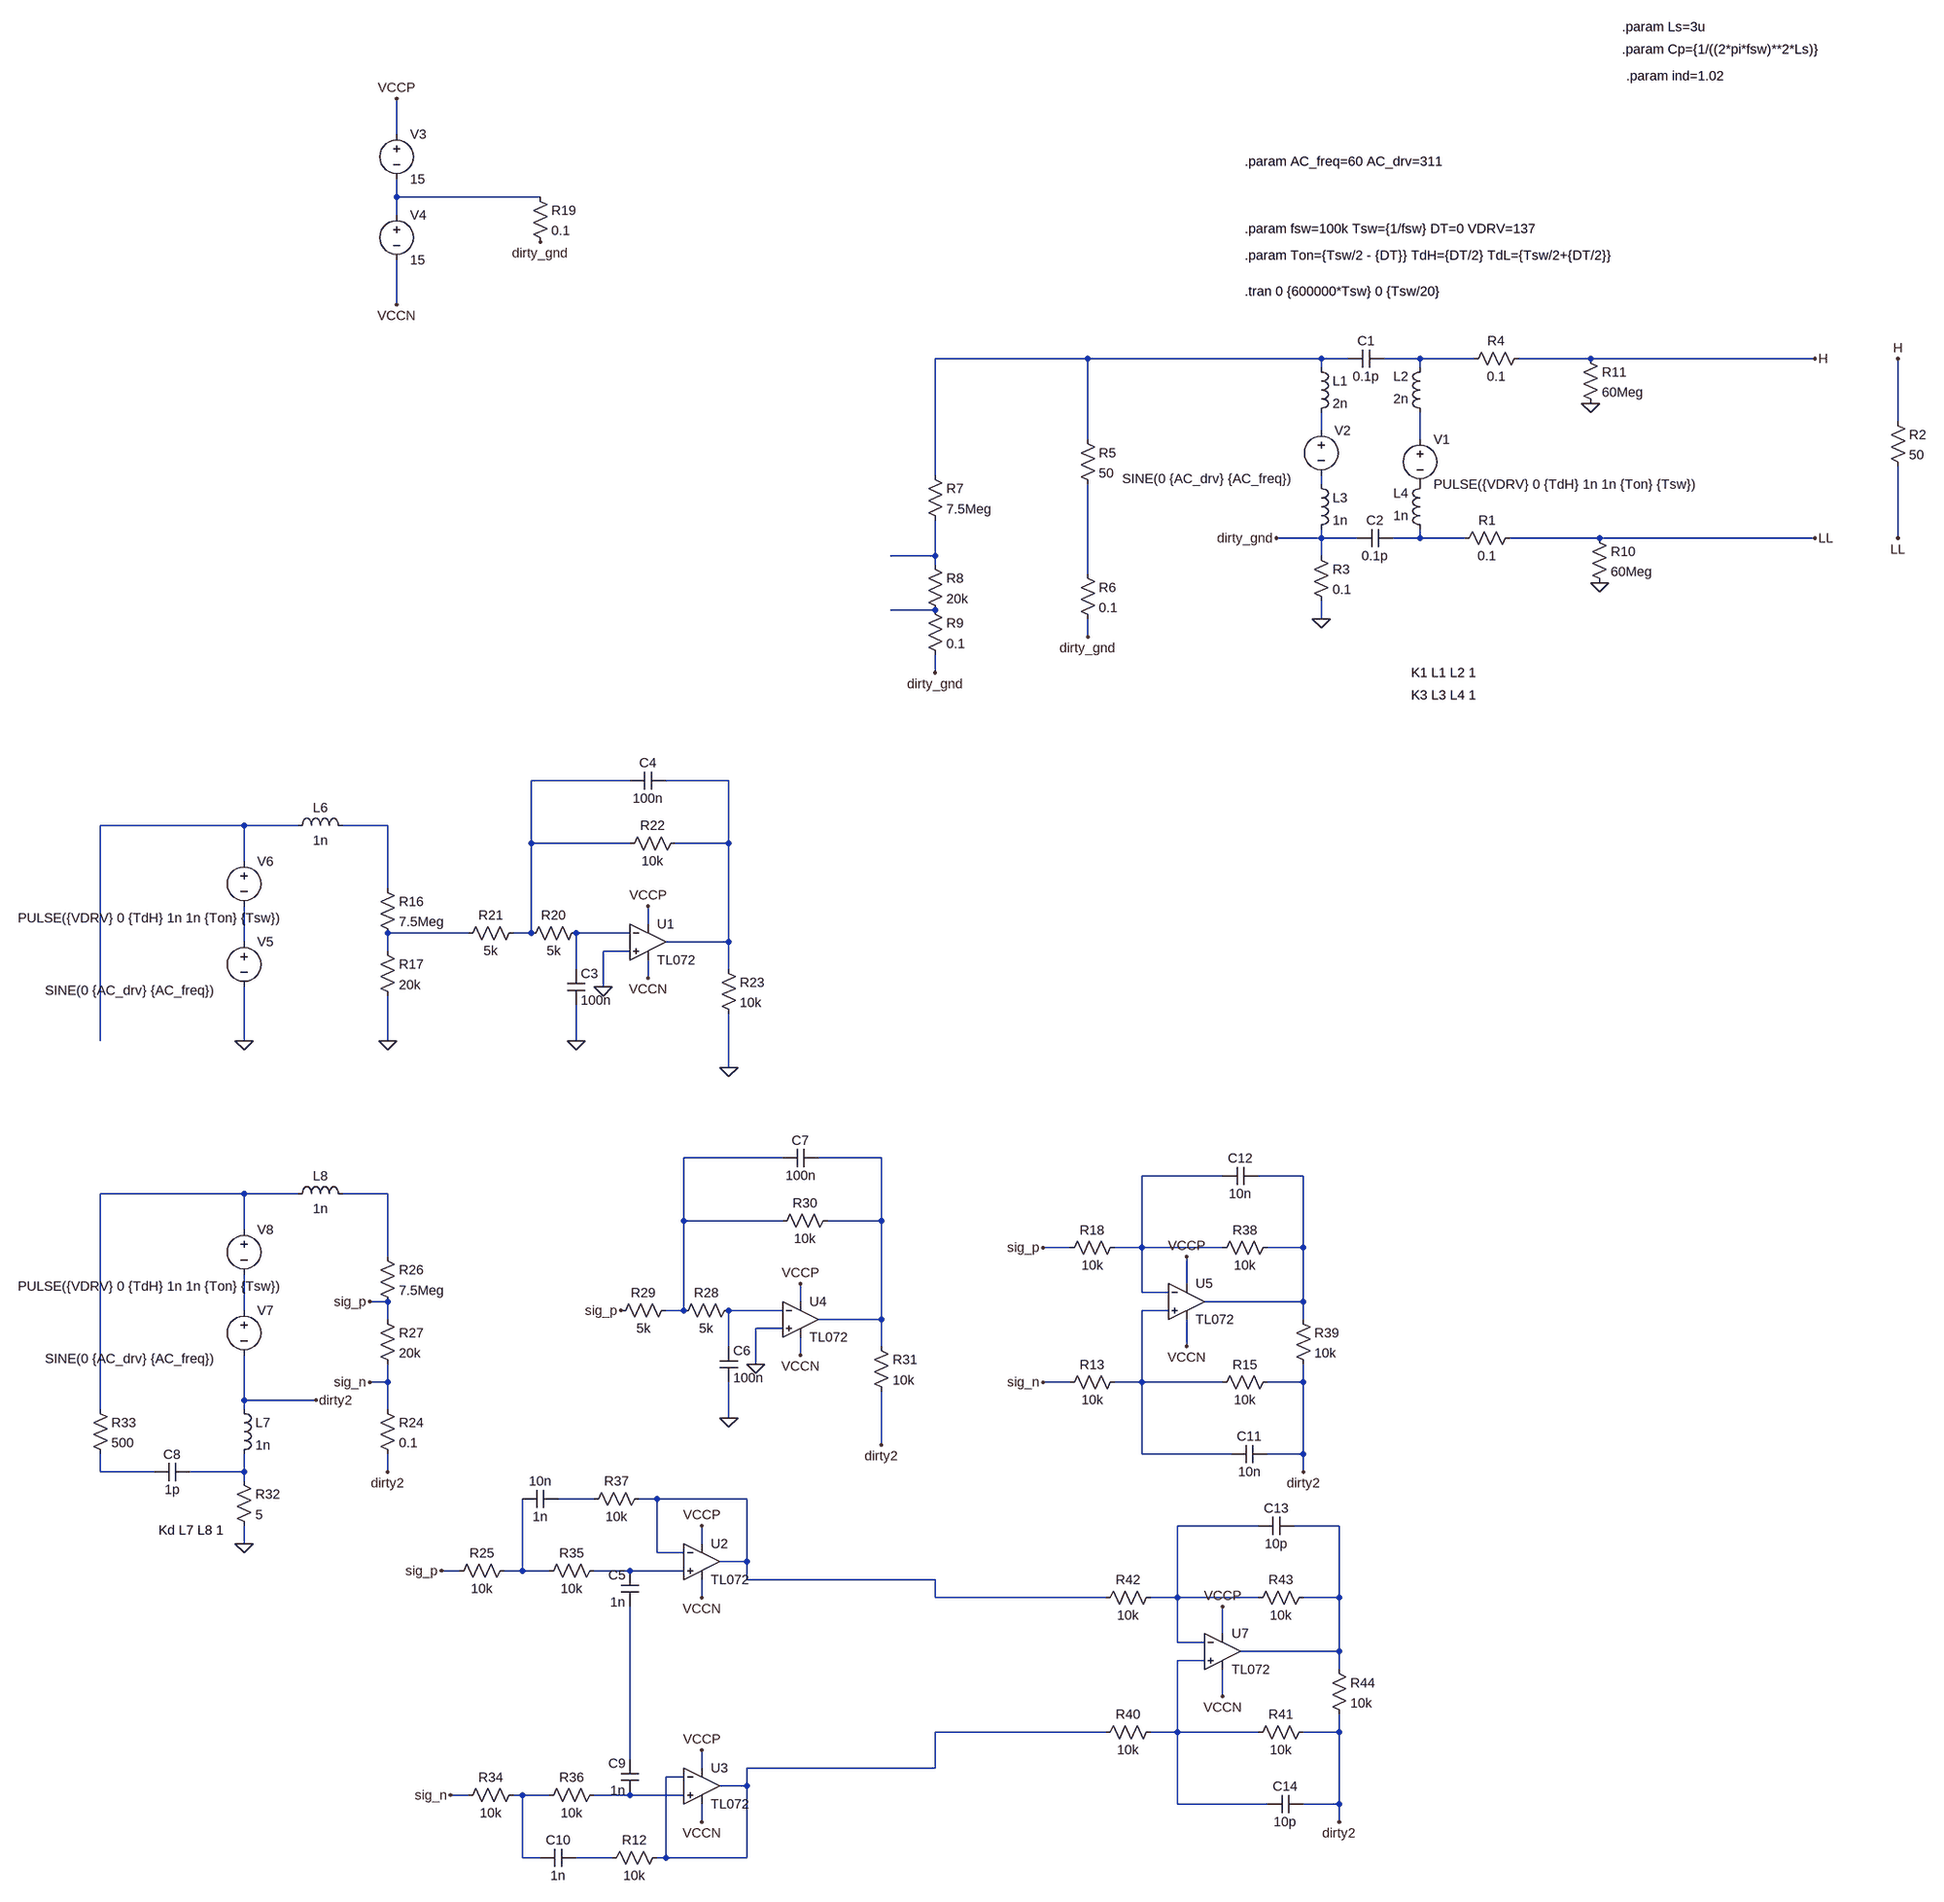
[diagram p0: schematic CM_Noise.asc]
CM_Noise.asc, the LTspice schematic file:
Version 4.1
SHEET 1 2900 3132
WIRE -1776 -320 -1776 -384
WIRE -1776 -208 -1776 -240
WIRE -1520 -208 -1776 -208
WIRE -1776 -176 -1776 -208
WIRE -1776 -16 -1776 -96
WIRE -544 80 -816 80
WIRE -128 80 -544 80
WIRE -80 80 -128 80
WIRE 48 80 -16 80
WIRE 144 80 48 80
WIRE 352 80 224 80
WIRE 752 80 352 80
WIRE -128 96 -128 80
WIRE 48 96 48 80
WIRE 1040 192 1040 80
WIRE -128 208 -128 176
WIRE -544 224 -544 80
WIRE 48 224 48 176
WIRE -816 288 -816 80
WIRE -128 304 -128 288
WIRE -128 400 -128 384
WIRE -128 400 -208 400
WIRE -64 400 -128 400
WIRE 48 400 48 384
WIRE 48 400 0 400
WIRE 128 400 48 400
WIRE 368 400 208 400
WIRE 752 400 368 400
WIRE 1040 400 1040 272
WIRE -816 432 -816 368
WIRE -816 432 -896 432
WIRE -128 432 -128 400
WIRE -816 448 -816 432
WIRE -544 464 -544 304
WIRE -816 528 -896 528
WIRE -128 544 -128 512
WIRE -544 576 -544 544
WIRE -816 640 -816 608
WIRE -1360 1024 -1536 1024
WIRE -1184 1024 -1296 1024
WIRE -2048 1104 -2304 1104
WIRE -1952 1104 -2048 1104
WIRE -1792 1104 -1872 1104
WIRE -1536 1136 -1536 1024
WIRE -1360 1136 -1536 1136
WIRE -1184 1136 -1184 1024
WIRE -1184 1136 -1280 1136
WIRE -2048 1168 -2048 1104
WIRE -1792 1216 -1792 1104
WIRE -1328 1280 -1328 1248
WIRE -1648 1296 -1792 1296
WIRE -1536 1296 -1536 1136
WIRE -1536 1296 -1568 1296
WIRE -1360 1296 -1456 1296
WIRE -2048 1312 -2048 1248
WIRE -1184 1312 -1184 1136
WIRE -1184 1312 -1296 1312
WIRE -1792 1328 -1792 1296
WIRE -1360 1328 -1408 1328
WIRE -1456 1360 -1456 1296
WIRE -1184 1360 -1184 1312
WIRE -1328 1376 -1328 1344
WIRE -1408 1392 -1408 1328
WIRE -2304 1488 -2304 1104
WIRE -2048 1488 -2048 1392
WIRE -1792 1488 -1792 1408
WIRE -1456 1488 -1456 1424
WIRE -1184 1536 -1184 1440
WIRE -1088 1792 -1264 1792
WIRE -912 1792 -1024 1792
WIRE -304 1824 -448 1824
WIRE -160 1824 -240 1824
WIRE -2048 1856 -2304 1856
WIRE -1952 1856 -2048 1856
WIRE -1792 1856 -1872 1856
WIRE -1264 1904 -1264 1792
WIRE -1088 1904 -1264 1904
WIRE -912 1904 -912 1792
WIRE -912 1904 -1008 1904
WIRE -2048 1920 -2048 1856
WIRE -576 1952 -624 1952
WIRE -448 1952 -448 1824
WIRE -448 1952 -496 1952
WIRE -304 1952 -448 1952
WIRE -160 1952 -160 1824
WIRE -160 1952 -224 1952
WIRE -1792 1968 -1792 1856
WIRE -368 2016 -368 1968
WIRE -448 2032 -448 1952
WIRE -400 2032 -448 2032
WIRE -1792 2048 -1824 2048
WIRE -1056 2048 -1056 2016
WIRE -160 2048 -160 1952
WIRE -160 2048 -336 2048
WIRE -2048 2064 -2048 2000
WIRE -1264 2064 -1264 1904
WIRE -1264 2064 -1296 2064
WIRE -1088 2064 -1184 2064
WIRE -400 2064 -448 2064
WIRE -1792 2080 -1792 2048
WIRE -912 2080 -912 1904
WIRE -912 2080 -1024 2080
WIRE -160 2080 -160 2048
WIRE -1088 2096 -1136 2096
WIRE -1184 2128 -1184 2064
WIRE -912 2128 -912 2080
WIRE -368 2128 -368 2080
WIRE -1056 2144 -1056 2112
WIRE -1136 2160 -1136 2096
WIRE -1792 2192 -1792 2160
WIRE -1792 2192 -1824 2192
WIRE -576 2192 -624 2192
WIRE -448 2192 -448 2064
WIRE -448 2192 -496 2192
WIRE -304 2192 -448 2192
WIRE -160 2192 -160 2160
WIRE -160 2192 -224 2192
WIRE -2048 2224 -2048 2144
WIRE -1920 2224 -2048 2224
WIRE -2304 2240 -2304 1856
WIRE -2048 2240 -2048 2224
WIRE -1792 2240 -1792 2192
WIRE -1184 2256 -1184 2192
WIRE -912 2304 -912 2208
WIRE -448 2320 -448 2192
WIRE -288 2320 -448 2320
WIRE -160 2320 -160 2192
WIRE -160 2320 -224 2320
WIRE -2304 2352 -2304 2320
WIRE -2208 2352 -2304 2352
WIRE -2048 2352 -2048 2320
WIRE -2048 2352 -2144 2352
WIRE -1792 2352 -1792 2320
WIRE -160 2352 -160 2320
WIRE -2048 2368 -2048 2352
WIRE -1424 2400 -1488 2400
WIRE -1312 2400 -1344 2400
WIRE -1152 2400 -1312 2400
WIRE -240 2448 -384 2448
WIRE -96 2448 -176 2448
WIRE -2048 2480 -2048 2448
WIRE -1232 2480 -1232 2448
WIRE -1312 2496 -1312 2400
WIRE -1264 2496 -1312 2496
WIRE -1152 2512 -1152 2400
WIRE -1152 2512 -1200 2512
WIRE -1664 2528 -1696 2528
WIRE -1552 2528 -1552 2400
WIRE -1552 2528 -1584 2528
WIRE -1504 2528 -1552 2528
WIRE -1360 2528 -1424 2528
WIRE -1264 2528 -1360 2528
WIRE -1152 2544 -1152 2512
WIRE -816 2544 -1152 2544
WIRE -1232 2576 -1232 2544
WIRE -816 2576 -816 2544
WIRE -512 2576 -816 2576
WIRE -384 2576 -384 2448
WIRE -384 2576 -432 2576
WIRE -240 2576 -384 2576
WIRE -96 2576 -96 2448
WIRE -96 2576 -160 2576
WIRE -304 2640 -304 2592
WIRE -384 2656 -384 2576
WIRE -336 2656 -384 2656
WIRE -96 2672 -96 2576
WIRE -96 2672 -272 2672
WIRE -336 2688 -384 2688
WIRE -96 2704 -96 2672
WIRE -304 2752 -304 2704
WIRE -512 2816 -816 2816
WIRE -384 2816 -384 2688
WIRE -384 2816 -432 2816
WIRE -240 2816 -384 2816
WIRE -96 2816 -96 2784
WIRE -96 2816 -160 2816
WIRE -1360 2864 -1360 2592
WIRE -1232 2880 -1232 2848
WIRE -816 2880 -816 2816
WIRE -816 2880 -1152 2880
WIRE -1264 2896 -1296 2896
WIRE -1152 2912 -1152 2880
WIRE -1152 2912 -1200 2912
WIRE -1648 2928 -1680 2928
WIRE -1552 2928 -1568 2928
WIRE -1504 2928 -1552 2928
WIRE -1360 2928 -1424 2928
WIRE -1264 2928 -1360 2928
WIRE -384 2944 -384 2816
WIRE -224 2944 -384 2944
WIRE -96 2944 -96 2816
WIRE -96 2944 -160 2944
WIRE -1232 2976 -1232 2944
WIRE -96 2976 -96 2944
WIRE -1552 3040 -1552 2928
WIRE -1520 3040 -1552 3040
WIRE -1392 3040 -1456 3040
WIRE -1296 3040 -1296 2896
WIRE -1296 3040 -1312 3040
WIRE -1152 3040 -1152 2912
WIRE -1152 3040 -1296 3040
FLAG 752 80 H
FLAG 752 400 LL
FLAG 352 160 0
FLAG 368 480 0
FLAG 1040 80 H
FLAG 1040 400 LL
FLAG -128 544 0
FLAG -208 400 dirty_gnd
FLAG -1520 -128 dirty_gnd
FLAG -1776 -384 VCCP
FLAG -1776 -16 VCCN
FLAG -1232 2448 VCCP
FLAG -1232 2848 VCCP
FLAG -1232 2976 VCCN
FLAG -1232 2576 VCCN
FLAG -544 576 dirty_gnd
FLAG -816 640 dirty_gnd
FLAG -1696 2528 sig_p
FLAG -1680 2928 sig_n
FLAG -1328 1248 VCCP
FLAG -1328 1376 VCCN
FLAG -1408 1392 0
FLAG -1184 1536 0
FLAG -1056 2016 VCCP
FLAG -1056 2144 VCCN
FLAG -2048 2480 0
FLAG -1136 2160 0
FLAG -1920 2224 dirty2
FLAG -1792 2352 dirty2
FLAG -1456 1488 0
FLAG -1792 1488 0
FLAG -2048 1488 0
FLAG -1824 2048 sig_p
FLAG -1824 2192 sig_n
FLAG -1376 2064 sig_p
FLAG -624 2192 sig_n
FLAG -624 1952 sig_p
FLAG -368 1968 VCCP
FLAG -368 2128 VCCN
FLAG -1184 2256 0
FLAG -304 2592 VCCP
FLAG -304 2752 VCCN
FLAG -912 2304 dirty2
FLAG -160 2352 dirty2
FLAG -96 2976 dirty2
SYMBOL voltage 48 208 R0
WINDOW 123 0 0 Left 0
WINDOW 39 0 0 Left 0
SYMATTR InstName V1
SYMATTR Value PULSE({VDRV} 0 {TdH} 1n 1n {Ton} {Tsw})
SYMBOL res 352 384 R0
SYMATTR InstName R10
SYMATTR Value 60Meg
SYMBOL res 336 64 R0
SYMATTR InstName R11
SYMATTR Value 60Meg
SYMBOL res 112 416 R270
WINDOW 0 32 56 VTop 2
WINDOW 3 0 56 VBottom 2
SYMATTR InstName R1
SYMATTR Value 0.1
SYMBOL res 1024 176 R0
SYMATTR InstName R2
SYMATTR Value 50
SYMBOL voltage -128 192 R0
WINDOW 123 0 0 Left 0
WINDOW 39 0 0 Left 0
WINDOW 3 -355 102 Left 2
SYMATTR Value SINE(0 {AC_drv} {AC_freq})
SYMATTR InstName V2
SYMBOL res -144 416 R0
SYMATTR InstName R3
SYMATTR Value 0.1
SYMBOL res -560 208 R0
SYMATTR InstName R5
SYMATTR Value 50
SYMBOL res 128 96 R270
WINDOW 0 32 56 VTop 2
WINDOW 3 0 56 VBottom 2
SYMATTR InstName R4
SYMATTR Value 0.1
SYMBOL cap -16 64 R90
WINDOW 0 0 32 VBottom 2
WINDOW 3 32 32 VTop 2
SYMATTR InstName C1
SYMATTR Value 0.1p
SYMBOL cap 0 384 R90
WINDOW 0 0 32 VBottom 2
WINDOW 3 32 32 VTop 2
SYMATTR InstName C2
SYMATTR Value 0.1p
SYMBOL ind -144 80 R0
SYMATTR InstName L1
SYMATTR Value 2n
SYMATTR Type ind
SYMATTR SpiceLine Rser=1m
SYMBOL ind 64 192 R180
WINDOW 0 36 80 Left 2
WINDOW 3 36 40 Left 2
SYMATTR InstName L2
SYMATTR Value 2n
SYMATTR Type ind
SYMATTR SpiceLine Rser=1m
SYMBOL ind -144 288 R0
SYMATTR InstName L3
SYMATTR Value 1n
SYMATTR Type ind
SYMATTR SpiceLine Rser=1m
SYMBOL ind 64 400 R180
WINDOW 0 36 80 Left 2
WINDOW 3 36 40 Left 2
SYMATTR InstName L4
SYMATTR Value 1n
SYMATTR Type ind
SYMATTR SpiceLine Rser=1m
SYMBOL voltage -1776 -336 R0
WINDOW 123 0 0 Left 0
WINDOW 39 0 0 Left 0
SYMATTR InstName V3
SYMATTR Value 15
SYMBOL voltage -1776 -192 R0
WINDOW 123 0 0 Left 0
WINDOW 39 0 0 Left 0
SYMATTR InstName V4
SYMATTR Value 15
SYMBOL res -560 448 R0
SYMATTR InstName R6
SYMATTR Value 0.1
SYMBOL res -832 272 R0
SYMATTR InstName R7
SYMATTR Value 7.5Meg
SYMBOL res -832 432 R0
SYMATTR InstName R8
SYMATTR Value 20k
SYMBOL res -832 512 R0
SYMATTR InstName R9
SYMATTR Value 0.1
SYMBOL TL072 -1232 2448 R0
SYMATTR InstName U2
SYMBOL TL072 -1232 2848 R0
SYMATTR InstName U3
SYMBOL res -1536 -224 R0
SYMATTR InstName R19
SYMATTR Value 0.1
SYMBOL TL072 -1328 1248 R0
SYMATTR InstName U1
SYMBOL voltage -2048 1296 R0
WINDOW 123 0 0 Left 0
WINDOW 39 0 0 Left 0
WINDOW 3 -355 102 Left 2
SYMATTR Value SINE(0 {AC_drv} {AC_freq})
SYMATTR InstName V5
SYMBOL voltage -2048 1152 R0
WINDOW 123 0 0 Left 0
WINDOW 39 0 0 Left 0
WINDOW 3 -403 117 Left 2
SYMATTR Value PULSE({VDRV} 0 {TdH} 1n 1n {Ton} {Tsw})
SYMATTR InstName V6
SYMBOL res -1808 1200 R0
SYMATTR InstName R16
SYMATTR Value 7.5Meg
SYMBOL res -1808 1312 R0
SYMATTR InstName R17
SYMATTR Value 20k
SYMBOL cap -1472 1360 R0
SYMATTR InstName C3
SYMATTR Value 100n
SYMBOL res -1440 1280 R90
WINDOW 0 0 56 VBottom 2
WINDOW 3 32 56 VTop 2
SYMATTR InstName R20
SYMATTR Value 5k
SYMBOL res -1552 1280 R90
WINDOW 0 0 56 VBottom 2
WINDOW 3 32 56 VTop 2
SYMATTR InstName R21
SYMATTR Value 5k
SYMBOL res -1264 1120 R90
WINDOW 0 0 56 VBottom 2
WINDOW 3 32 56 VTop 2
SYMATTR InstName R22
SYMATTR Value 10k
SYMBOL cap -1296 1008 R90
WINDOW 0 0 32 VBottom 2
WINDOW 3 32 32 VTop 2
SYMATTR InstName C4
SYMATTR Value 100n
SYMBOL res -1200 1344 R0
SYMATTR InstName R23
SYMATTR Value 10k
SYMBOL ind -1968 1120 R270
WINDOW 0 32 56 VTop 2
WINDOW 3 5 56 VBottom 2
SYMATTR InstName L6
SYMATTR Value 1n
SYMATTR SpiceLine Rser=1m
SYMBOL TL072 -1056 2016 R0
SYMATTR InstName U4
SYMBOL voltage -2048 2048 R0
WINDOW 123 0 0 Left 0
WINDOW 39 0 0 Left 0
WINDOW 3 -355 102 Left 2
SYMATTR Value SINE(0 {AC_drv} {AC_freq})
SYMATTR InstName V7
SYMBOL voltage -2048 1904 R0
WINDOW 123 0 0 Left 0
WINDOW 39 0 0 Left 0
WINDOW 3 -403 117 Left 2
SYMATTR Value PULSE({VDRV} 0 {TdH} 1n 1n {Ton} {Tsw})
SYMATTR InstName V8
SYMBOL res -1808 1952 R0
SYMATTR InstName R26
SYMATTR Value 7.5Meg
SYMBOL res -1808 2064 R0
SYMATTR InstName R27
SYMATTR Value 20k
SYMBOL cap -1200 2128 R0
SYMATTR InstName C6
SYMATTR Value 100n
SYMBOL res -1168 2048 R90
WINDOW 0 0 56 VBottom 2
WINDOW 3 32 56 VTop 2
SYMATTR InstName R28
SYMATTR Value 5k
SYMBOL res -1280 2048 R90
WINDOW 0 0 56 VBottom 2
WINDOW 3 32 56 VTop 2
SYMATTR InstName R29
SYMATTR Value 5k
SYMBOL res -992 1888 R90
WINDOW 0 0 56 VBottom 2
WINDOW 3 32 56 VTop 2
SYMATTR InstName R30
SYMATTR Value 10k
SYMBOL cap -1024 1776 R90
WINDOW 0 0 32 VBottom 2
WINDOW 3 32 32 VTop 2
SYMATTR InstName C7
SYMATTR Value 100n
SYMBOL res -928 2112 R0
SYMATTR InstName R31
SYMATTR Value 10k
SYMBOL ind -2064 2224 R0
SYMATTR InstName L7
SYMATTR Value 1n
SYMATTR Type ind
SYMATTR SpiceLine Rser=1m
SYMBOL ind -1968 1872 R270
WINDOW 0 32 56 VTop 2
WINDOW 3 5 56 VBottom 2
SYMATTR InstName L8
SYMATTR Value 1n
SYMATTR Type ind
SYMATTR SpiceLine Rser=1m
SYMBOL res -2064 2352 R0
SYMATTR InstName R32
SYMATTR Value 5
SYMBOL cap -2144 2336 R90
WINDOW 0 0 32 VBottom 2
WINDOW 3 32 32 VTop 2
SYMATTR InstName C8
SYMATTR Value 1p
SYMBOL res -2320 2224 R0
SYMATTR InstName R33
SYMATTR Value 500
SYMBOL res -1808 2224 R0
SYMATTR InstName R24
SYMATTR Value 0.1
SYMBOL res -1568 2512 R90
WINDOW 0 0 56 VBottom 2
WINDOW 3 32 56 VTop 2
SYMATTR InstName R25
SYMATTR Value 10k
SYMBOL res -1552 2912 R90
WINDOW 0 0 56 VBottom 2
WINDOW 3 32 56 VTop 2
SYMATTR InstName R34
SYMATTR Value 10k
SYMBOL res -1408 2512 R90
WINDOW 0 0 56 VBottom 2
WINDOW 3 32 56 VTop 2
SYMATTR InstName R35
SYMATTR Value 10k
SYMBOL res -1408 2912 R90
WINDOW 0 0 56 VBottom 2
WINDOW 3 32 56 VTop 2
SYMATTR InstName R36
SYMATTR Value 10k
SYMBOL cap -1488 2384 R90
WINDOW 0 0 32 VBottom 2
WINDOW 3 32 32 VTop 2
SYMATTR InstName 10n
SYMATTR Value 1n
SYMBOL res -1328 2384 R90
WINDOW 0 0 56 VBottom 2
WINDOW 3 32 56 VTop 2
SYMATTR InstName R37
SYMATTR Value 10k
SYMBOL cap -1344 2592 R180
WINDOW 0 24 56 Left 2
WINDOW 3 24 8 Left 2
SYMATTR InstName C5
SYMATTR Value 1n
SYMBOL cap -1344 2928 R180
WINDOW 0 24 56 Left 2
WINDOW 3 24 8 Left 2
SYMATTR InstName C9
SYMATTR Value 1n
SYMBOL cap -1456 3024 R90
WINDOW 0 0 32 VBottom 2
WINDOW 3 32 32 VTop 2
SYMATTR InstName C10
SYMATTR Value 1n
SYMBOL res -1296 3024 R90
WINDOW 0 0 56 VBottom 2
WINDOW 3 32 56 VTop 2
SYMATTR InstName R12
SYMATTR Value 10k
SYMBOL TL072 -368 1984 R0
SYMATTR InstName U5
SYMBOL res -480 2176 R90
WINDOW 0 0 56 VBottom 2
WINDOW 3 32 56 VTop 2
SYMATTR InstName R13
SYMATTR Value 10k
SYMBOL res -208 2176 R90
WINDOW 0 0 56 VBottom 2
WINDOW 3 32 56 VTop 2
SYMATTR InstName R15
SYMATTR Value 10k
SYMBOL res -480 1936 R90
WINDOW 0 0 56 VBottom 2
WINDOW 3 32 56 VTop 2
SYMATTR InstName R18
SYMATTR Value 10k
SYMBOL res -208 1936 R90
WINDOW 0 0 56 VBottom 2
WINDOW 3 32 56 VTop 2
SYMATTR InstName R38
SYMATTR Value 10k
SYMBOL cap -224 2304 R90
WINDOW 0 0 32 VBottom 2
WINDOW 3 32 32 VTop 2
SYMATTR InstName C11
SYMATTR Value 10n
SYMBOL cap -240 1808 R90
WINDOW 0 0 32 VBottom 2
WINDOW 3 32 32 VTop 2
SYMATTR InstName C12
SYMATTR Value 10n
SYMBOL res -176 2064 R0
SYMATTR InstName R39
SYMATTR Value 10k
SYMBOL TL072 -304 2608 R0
SYMATTR InstName U7
SYMBOL res -416 2800 R90
WINDOW 0 0 56 VBottom 2
WINDOW 3 32 56 VTop 2
SYMATTR InstName R40
SYMATTR Value 10k
SYMBOL res -144 2800 R90
WINDOW 0 0 56 VBottom 2
WINDOW 3 32 56 VTop 2
SYMATTR InstName R41
SYMATTR Value 10k
SYMBOL res -416 2560 R90
WINDOW 0 0 56 VBottom 2
WINDOW 3 32 56 VTop 2
SYMATTR InstName R42
SYMATTR Value 10k
SYMBOL res -144 2560 R90
WINDOW 0 0 56 VBottom 2
WINDOW 3 32 56 VTop 2
SYMATTR InstName R43
SYMATTR Value 10k
SYMBOL res -112 2688 R0
SYMATTR InstName R44
SYMATTR Value 10k
SYMBOL cap -176 2432 R90
WINDOW 0 0 32 VBottom 2
WINDOW 3 32 32 VTop 2
SYMATTR InstName C13
SYMATTR Value 10p
SYMBOL cap -160 2928 R90
WINDOW 0 0 32 VBottom 2
WINDOW 3 32 32 VTop 2
SYMATTR InstName C14
SYMATTR Value 10p
TEXT -264 -152 Left 2 !.param fsw=100k Tsw={1/fsw} DT=0 VDRV=137
TEXT -264 -104 Left 2 !.param Ton={Tsw/2 - {DT}} TdH={DT/2} TdL={Tsw/2+{DT/2}}
TEXT -264 -40 Left 2 !.tran 0 {600000*Tsw} 0 {Tsw/20}
TEXT 408 -472 Left 2 !.param Cp={1/((2*pi*fsw)**2*Ls)}
TEXT 408 -512 Left 2 !.param Ls=3u
TEXT 416 -424 Left 2 !.param ind=1.02
TEXT -264 -272 Left 2 !.param AC_freq=60 AC_drv=311
TEXT 32 640 Left 2 !K1 L1 L2 1
TEXT 32 680 Left 2 !K3 L3 L4 1
TEXT -2200 2456 Left 2 !Kd L7 L8 1

The netlist it stands for:
* CM_Noise.asc
V1 N005 P001 PULSE({VDRV} 0 {TdH} 1n 1n {Ton} {Tsw})
R10 LL 0 60Meg
R11 H 0 60Meg
R1 N007 LL 0.1
R2 H LL 50
V2 N004 N006 SINE(0 {AC_drv} {AC_freq})
R3 dirty_gnd 0 0.1
R5 N002 N009 50
R4 N003 H 0.1
C1 N003 N002 0.1p
C2 N007 dirty_gnd 0.1p
L1 N002 N004 2n Rser=1m
L2 N005 N003 2n Rser=1m
L3 N006 dirty_gnd 1n Rser=1m
L4 N007 P001 1n Rser=1m
V3 VCCP N001 15
V4 N001 VCCN 15
R6 N009 dirty_gnd 0.1
R7 N002 N008 7.5Meg
R8 N008 N010 20k
R9 N010 dirty_gnd 0.1
* U2: TL072 (symbol TL072 not available, pins judged from their places): In+=N034 In-=N030 V+=VCCP V-=VCCN OUT=N030
* U3: TL072 (symbol TL072 not available, pins judged from their places): In+=N039 In-=N036 V+=VCCP V-=VCCN OUT=N036
R19 N001 dirty_gnd 0.1
* U1: TL072 (symbol TL072 not available, pins judged from their places): In+=0 In-=N016 V+=VCCP V-=VCCN OUT=N012
V5 N017 0 SINE(0 {AC_drv} {AC_freq})
V6 N013 N017 PULSE({VDRV} 0 {TdH} 1n 1n {Ton} {Tsw})
R16 N014 N015 7.5Meg
R17 N015 0 20k
C3 N016 0 100n
R20 N016 N011 5k
R21 N011 N015 5k
R22 N012 N011 10k
C4 N012 N011 100n
R23 N012 0 10k
L6 N013 N014 1n Rser=1m
* U4: TL072 (symbol TL072 not available, pins judged from their places): In+=0 In-=N025 V+=VCCP V-=VCCN OUT=N019
V7 N024 dirty2 SINE(0 {AC_drv} {AC_freq})
V8 N022 N024 PULSE({VDRV} 0 {TdH} 1n 1n {Ton} {Tsw})
R26 N023 sig_p 7.5Meg
R27 sig_p sig_n 20k
C6 N025 0 100n
R28 N025 N018 5k
R29 N018 sig_p 5k
R30 N019 N018 10k
C7 N019 N018 100n
R31 N019 dirty2 10k
L7 dirty2 N028 1n Rser=1m
L8 N022 N023 1n Rser=1m
R32 N028 0 5
C8 N028 N027 1p
R33 N022 N027 500
R24 sig_n dirty2 0.1
R25 N033 sig_p 10k
R34 N038 sig_n 10k
R35 N034 N033 10k
R36 N039 N038 10k
C§10n N029 N033 1n
R37 N030 N029 10k
C5 N037 N034 1n
C9 N039 N037 1n
C10 N040 N038 1n
R12 N036 N040 10k
* U5: TL072 (symbol TL072 not available, pins judged from their places): In+=N026 In-=N020 V+=VCCP V-=VCCN OUT=N021
R13 N026 sig_n 10k
R15 dirty2 N026 10k
R18 N020 sig_p 10k
R38 N021 N020 10k
C11 dirty2 N026 10n
C12 N021 N020 10n
R39 N021 dirty2 10k
* U7: TL072 (symbol TL072 not available, pins judged from their places): In+=N035 In-=N031 V+=VCCP V-=VCCN OUT=N032
R40 N035 N036 10k
R41 dirty2 N035 10k
R42 N031 N030 10k
R43 N032 N031 10k
R44 N032 dirty2 10k
C13 N032 N031 10p
C14 dirty2 N035 10p
.param fsw=100k Tsw={1/fsw} DT=0 VDRV=137
.param Ton={Tsw/2 - {DT}} TdH={DT/2} TdL={Tsw/2+{DT/2}}
.tran 0 {600000*Tsw} 0 {Tsw/20}
.param Cp={1/((2*pi*fsw)**2*Ls)}
.param Ls=3u
.param ind=1.02
.param AC_freq=60 AC_drv=311
K1 L1 L2 1
K3 L3 L4 1
Kd L7 L8 1
.backanno
.end